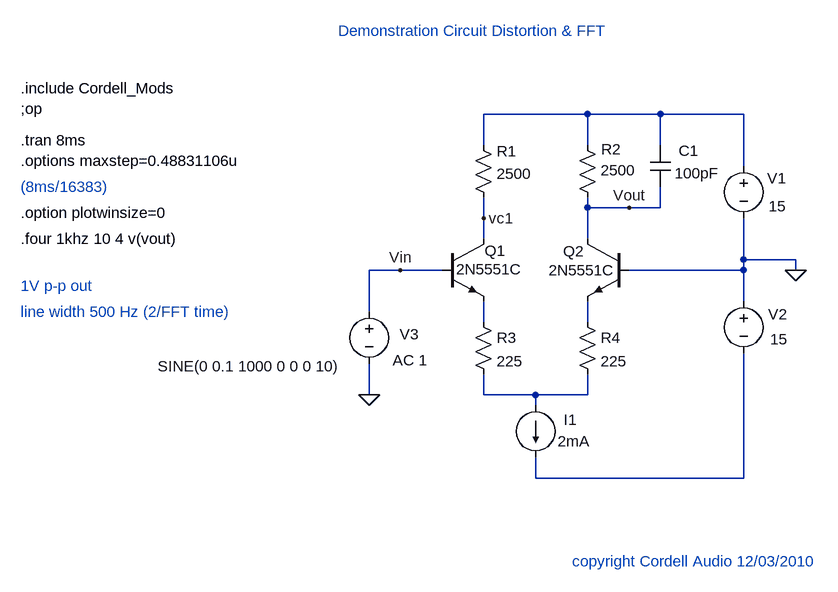
[diagram p0: schematic Demonstration circuit.asc]
Demonstration circuit.asc, the LTspice schematic file:
Version 4
SHEET 1 880 772
WIRE 160 64 0 64
WIRE 272 64 160 64
WIRE 400 64 272 64
WIRE 0 112 0 64
WIRE 160 112 160 64
WIRE 272 112 272 64
WIRE 400 144 400 64
WIRE 160 208 160 192
WIRE 224 208 160 208
WIRE 272 208 272 176
WIRE 272 208 224 208
WIRE 0 224 0 192
WIRE 0 256 0 224
WIRE 160 256 160 208
WIRE 400 288 400 224
WIRE 480 288 400 288
WIRE -128 304 -176 304
WIRE -64 304 -128 304
WIRE 400 304 400 288
WIRE 400 304 224 304
WIRE 480 304 480 288
WIRE 400 352 400 304
WIRE -176 368 -176 304
WIRE 0 384 0 352
WIRE 160 384 160 352
WIRE -176 496 -176 448
WIRE 0 496 0 464
WIRE 80 496 0 496
WIRE 160 496 160 464
WIRE 160 496 80 496
WIRE 80 512 80 496
WIRE 80 624 80 592
WIRE 400 624 400 432
WIRE 400 624 80 624
FLAG 480 304 0
FLAG -176 496 0
FLAG -128 304 Vin
FLAG 224 208 Vout
FLAG 0 224 vc1
SYMBOL res -16 96 R0
WINDOW 0 36 25 Left 0
WINDOW 3 36 60 Left 0
SYMATTR InstName R1
SYMATTR Value 2500
SYMBOL res 144 96 R0
WINDOW 0 37 22 Left 0
WINDOW 3 36 54 Left 0
SYMATTR InstName R2
SYMATTR Value 2500
SYMBOL voltage 400 128 R0
WINDOW 123 0 0 Left 0
WINDOW 39 0 0 Left 0
WINDOW 0 36 35 Left 0
WINDOW 3 39 78 Left 0
SYMATTR InstName V1
SYMATTR Value 15
SYMBOL voltage 400 336 R0
WINDOW 123 0 0 Left 0
WINDOW 39 0 0 Left 0
WINDOW 0 38 36 Left 0
WINDOW 3 41 74 Left 0
SYMATTR InstName V2
SYMATTR Value 15
SYMBOL npn -64 256 R0
WINDOW 3 22 47 Left 0
WINDOW 0 66 18 Left 0
SYMATTR Value 2N5551C
SYMATTR InstName Q1
SYMBOL npn 224 256 M0
WINDOW 3 22 48 Left 0
WINDOW 0 69 19 Left 0
SYMATTR Value 2N5551C
SYMATTR InstName Q2
SYMBOL res -16 368 R0
SYMATTR InstName R3
SYMATTR Value 225
SYMBOL res 144 368 R0
SYMATTR InstName R4
SYMATTR Value 225
SYMBOL current 80 512 R0
WINDOW 123 0 0 Left 0
WINDOW 39 0 0 Left 0
WINDOW 0 43 22 Left 0
WINDOW 3 34 55 Left 0
SYMATTR InstName I1
SYMATTR Value 2mA
SYMBOL voltage -176 352 R0
WINDOW 3 -325 100 Left 0
WINDOW 123 36 91 Left 0
WINDOW 39 0 0 Left 0
WINDOW 0 47 51 Left 0
SYMATTR Value SINE(0 0.1 1000 0 0 0 10)
SYMATTR Value2 AC 1
SYMATTR InstName V3
SYMBOL cap 256 112 R0
WINDOW 3 38 43 Left 0
WINDOW 0 44 8 Left 0
SYMATTR Value 100pF
SYMATTR InstName C1
TEXT -712 56 Left 0 !;op
TEXT -712 104 Left 0 !.tran 8ms
TEXT -224 -64 Left 0 ;Demonstration Circuit Distortion & FFT
TEXT -712 136 Left 0 !.options maxstep=0.48831106u
TEXT -712 256 Left 0 !.four 1khz 10 4 v(vout)
TEXT -712 216 Left 0 !.option plotwinsize=0
TEXT -712 176 Left 0 ;(8ms/16383)
TEXT -712 368 Left 0 ;line width 500 Hz (2/FFT time)
TEXT -712 328 Left 0 ;1V p-p out
TEXT -712 24 Left 0 !.include Cordell_Mods
TEXT 136 752 Left 0 ;copyright Cordell Audio 12/03/2010

The netlist it stands for:
* Demonstration circuit.asc
R1 N001 vc1 2500
R2 N001 Vout 2500
V1 N001 0 15
V2 0 N005 15
Q1 vc1 Vin N002 0 2N5551C
Q2 Vout 0 N003 0 2N5551C
R3 N002 N004 225
R4 N003 N004 225
I1 N004 N005 2mA
V3 Vin 0 SINE(0 0.1 1000 0 0 0 10) AC 1
C1 N001 Vout 100pF
.model NPN NPN
.model PNP PNP
.lib standard.bjt
;op
.tran 8ms
* Demonstration Circuit Distortion & FFT
.options maxstep=0.48831106u
.four 1khz 10 4 v(vout)
.option plotwinsize=0
* (8ms/16383)
* line width 500 Hz (2/FFT time)
* 1V p-p out
.include Cordell_Mods
* copyright Cordell Audio 12/03/2010
.backanno
.end